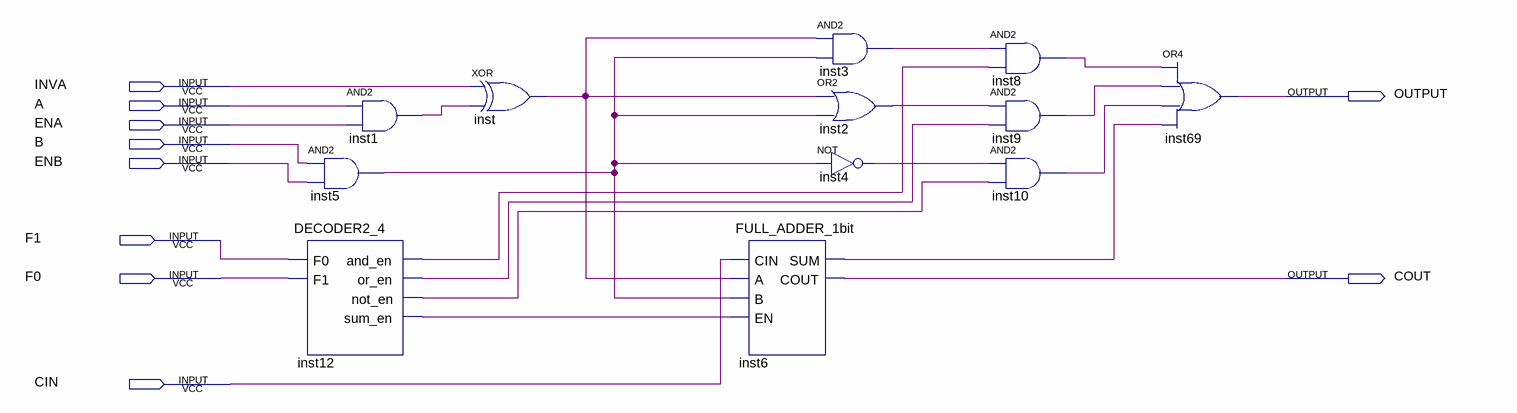
[diagram p0: schematic sheet]
// Quartus schematic ULA.bdf as structural Verilog: 12 symbols, 10 pins
module ULA (
  input  INVA,
  input  A,
  input  ENA,
  input  B,
  input  ENB,
  input  F1,
  input  F0,
  input  CIN,
  output OUTPUT,
  output COUT
);

  wire inst1_out, inst2_out, inst3_out, inst4_out, inst5_out, inst6_sum, inst8_out, inst9_out, inst10_out,
       inst12_and_en, inst12_not_en, inst12_or_en, inst12_sum_en, inst_out;

  and inst5 (inst5_out, B, ENB);
  DECODER2_4 inst12 (
    .F0(F1), .F1(F0), .and_en(inst12_and_en), .or_en(inst12_or_en), .not_en(inst12_not_en),
    .sum_en(inst12_sum_en));
  and inst1 (inst1_out, A, ENA);
  xor inst (inst_out, INVA, inst1_out);
  FULL_ADDER_1bit inst6 (.CIN(CIN), .A(inst_out), .B(inst5_out), .EN(inst12_sum_en), .SUM(inst6_sum), .COUT(COUT));
  and inst3 (inst3_out, inst_out, inst5_out);
  or inst2 (inst2_out, inst_out, inst5_out);
  not inst4 (inst4_out, inst5_out);
  and inst8 (inst8_out, inst3_out, inst12_and_en);
  and inst9 (inst9_out, inst2_out, inst12_or_en);
  and inst10 (inst10_out, inst4_out, inst12_not_en);
  or inst69 (OUTPUT, inst8_out, inst9_out, inst10_out, inst6_sum);
endmodule
